# Altium schematic sheet Sheet_1.3OLED.SchDoc
size A4
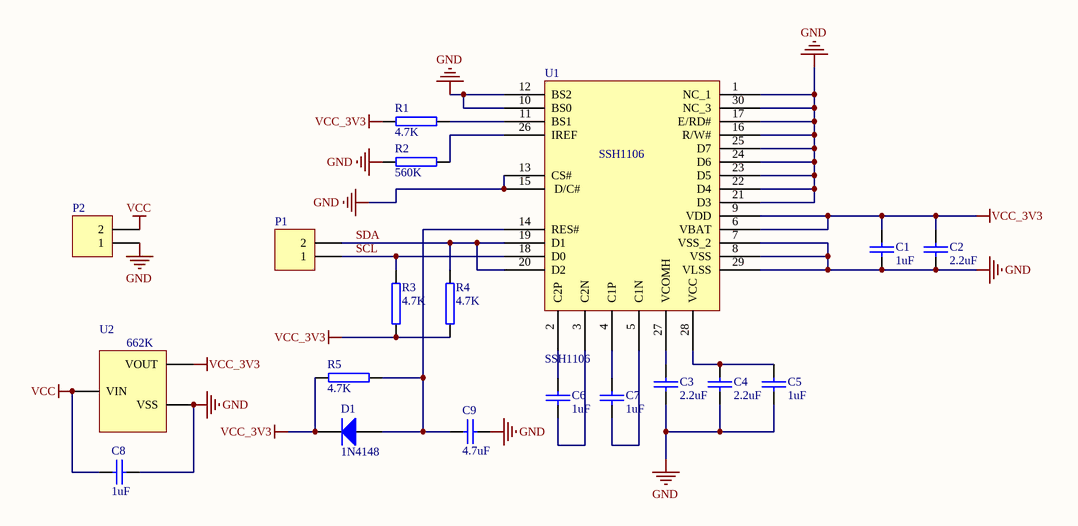
[diagram p0: Sheet_1.3OLED.SchDoc]

## Parts
C1  1uF  [C0603]
C2  2.2uF  [C0603]
C3  2.2uF  [C0603]
C4  2.2uF  [C0603]
C5  1uF  [C0603]
C6  1uF  [C0603]
C7  1uF  [C0603]
C8  1uF  [C0603]
C9  4.7uF  [C0603]
D1  1N4148  [1n4148]
P1  Header 2  [HDR1X2]  (value not drawn)
P2  Header 2  [HDR1X2]  (value not drawn)
R1  4.7K  [R0603]
R2  560K  [R0603]
R3  4.7K  [R0603]
R4  4.7K  [R0603]
R5  4.7K  [R0603]
U1  SSH1106  [SSH1106]
U2  Power  [662k]  (value not drawn)

## Nets
GND: C1.2 C2.2 C3.2 C4.2 C5.2 C8.2 C9.2 P2.1 R2.1 U1.1(NC_1) U1.7(VSS_2) U1.8(VSS) U1.10(BS0) U1.12(BS2) U1.13(CS#) U1.15(D/C#) U1.16(R/W#) U1.17(E/RD#) U1.21(D3) U1.22(D4) U1.23(D5) U1.24(D6) U1.25(D7) U1.29(VLSS) U1.30(NC_3) U2.1(VSS)
VCC: C8.1 P2.2 U2.3(VIN)
VCC_3V3: C1.1 C2.1 D1.2(K) R1.1 R3.1 R4.1 R5.1 U1.6(VBAT) U1.9(VDD) U2.2(VOUT)
SCL: P1.1 R3.2 U1.18(D0)
SDA: P1.2 R4.2 U1.19(D1) U1.20(D2)
NetC3_1: C3.1 U1.27(VCOMH)
NetC4_1: C4.1 C5.1 U1.28(VCC)
NetC6_1: C6.1 U1.2(C2P)
NetC6_2: C6.2 U1.3(C2N)
NetC7_1: C7.1 U1.4(C1P)
NetC7_2: C7.2 U1.5(C1N)
NetC9_1: C9.1 D1.1(A) R5.2 U1.14(RES#)
NetR1_2: R1.2 U1.11(BS1)
NetR2_2: R2.2 U1.26(IREF)

## Library data of the parts
C1-C9 = C0603: 贴片电容
D1 = 1N4148: 二极管
P1 P2 = Header 2: Header, 2-Pin; LatestRevisionDate: 17-Jul-2002; LatestRevisionNote: Re-released for DXP Platform.; Publisher: Altium Limited
R1-R5 = R0603: 贴片电阻
U1 = SSH1106: 1.3寸OLED
U2 = 662K: 稳压芯片